# Altium schematic sheet Waistband_shiftRegisters.SchDoc
size A; SheetNumber: 1; SheetTotal: 5
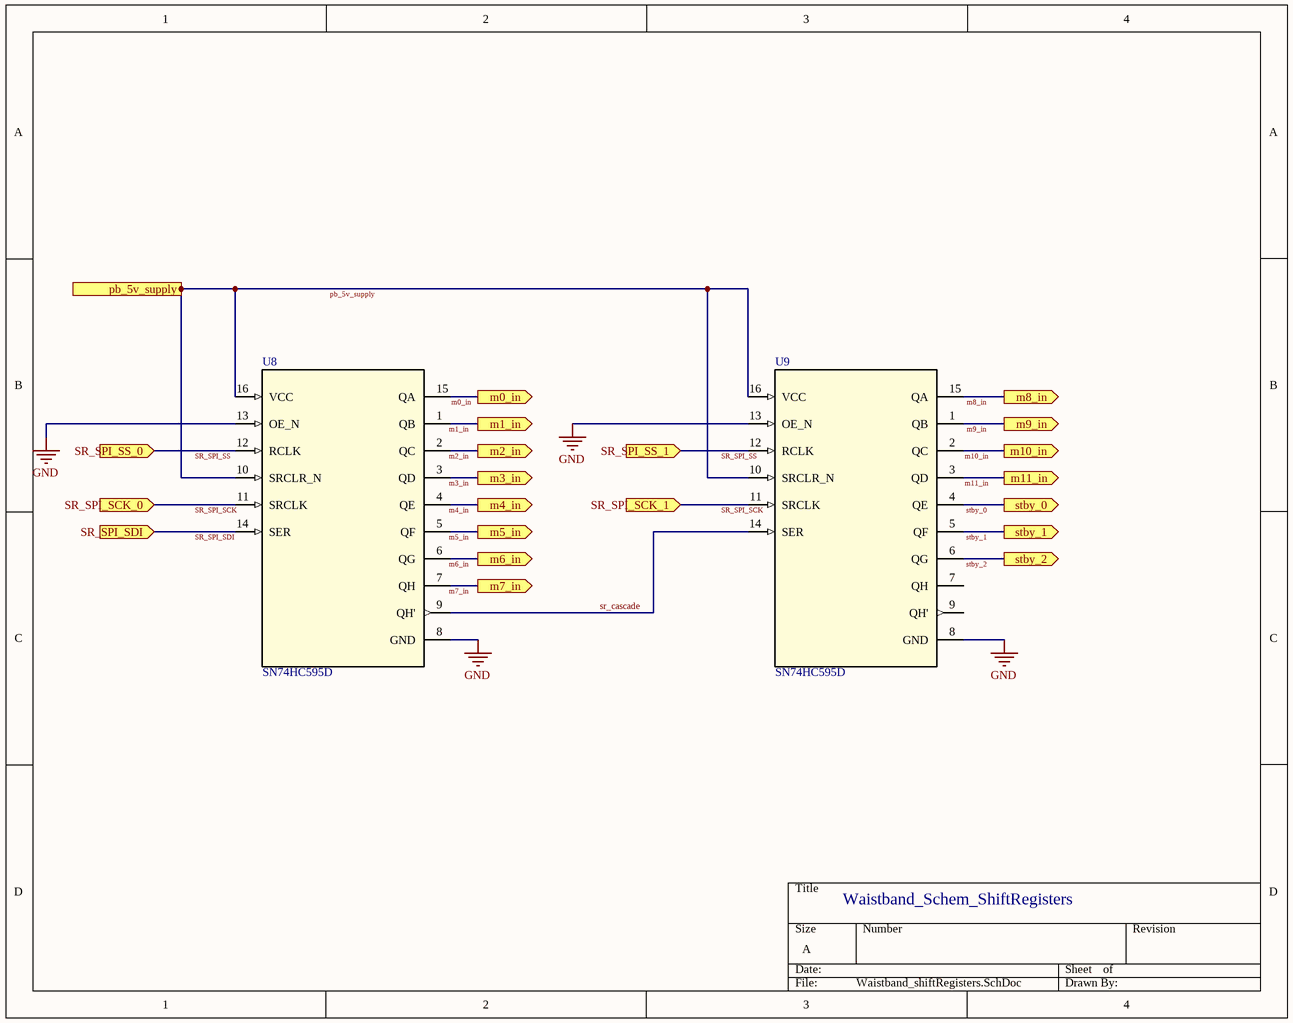
[diagram p0: Waistband_shiftRegisters.SchDoc]

## Parts
U8  SN74HC595D  [SN74HC595D]
U9  SN74HC595D  [SN74HC595D]

## Ports
m0_in (out), m1_in (out), m2_in (out), m3_in (out), m4_in (out), m5_in (out), m6_in (out), m7_in (out), m8_in (out), m9_in (out), m10_in (out), m11_in (out), pb_5v_supply (in), SR_SPI_SCK_0 (in), SR_SPI_SCK_1 (in), SR_SPI_SDI (in), SR_SPI_SS_0 (in), SR_SPI_SS_1 (in), stby_0 (out), stby_1 (out), stby_2 (out)

## Nets
GND: U8.8(GND) U8.13(OE_N) U9.8(GND) U9.13(OE_N)
m0_in: U8.15(QA) ; port m0_in
m1_in: U8.1(QB) ; port m1_in
m2_in: U8.2(QC) ; port m2_in
m3_in: U8.3(QD) ; port m3_in
m4_in: U8.4(QE) ; port m4_in
m5_in: U8.5(QF) ; port m5_in
m6_in: U8.6(QG) ; port m6_in
m7_in: U8.7(QH) ; port m7_in
m8_in: U9.15(QA) ; port m8_in
m9_in: U9.1(QB) ; port m9_in
m10_in: U9.2(QC) ; port m10_in
m11_in: U9.3(QD) ; port m11_in
pb_5v_supply: U8.10(SRCLR_N) U8.16(VCC) U9.10(SRCLR_N) U9.16(VCC) ; port pb_5v_supply
sr_cascade: U8.9(QH') U9.14(SER)
SR_SPI_SCK: U8.11(SRCLK) U9.11(SRCLK) ; port SR_SPI_SCK_0, port SR_SPI_SCK_1
SR_SPI_SDI: U8.14(SER) ; port SR_SPI_SDI
SR_SPI_SS: U8.12(RCLK) U9.12(RCLK) ; port SR_SPI_SS_0, port SR_SPI_SS_1
stby_0: U9.4(QE) ; port stby_0
stby_1: U9.5(QF) ; port stby_1
stby_2: U9.6(QG) ; port stby_2

Not connected (* = marked no-connect by the designer): U9 7(QH) 9(QH')

## Notes on the sheet
- Waistband_Schem_ShiftRegisters

## Library data of the parts
U8 U9 = SN74HC595D: No Description Available; Mfr_Name: Texas Instruments; Type: DEV; RefDes: RefDes; Copyright: Copyright (C) 2022 Ultra Librarian. All rights reserved.; Manufacturer_Part_Number: SN74HC595D